# EAGLE design cellyjamjam_v2 (EAGLE 6.5.0)
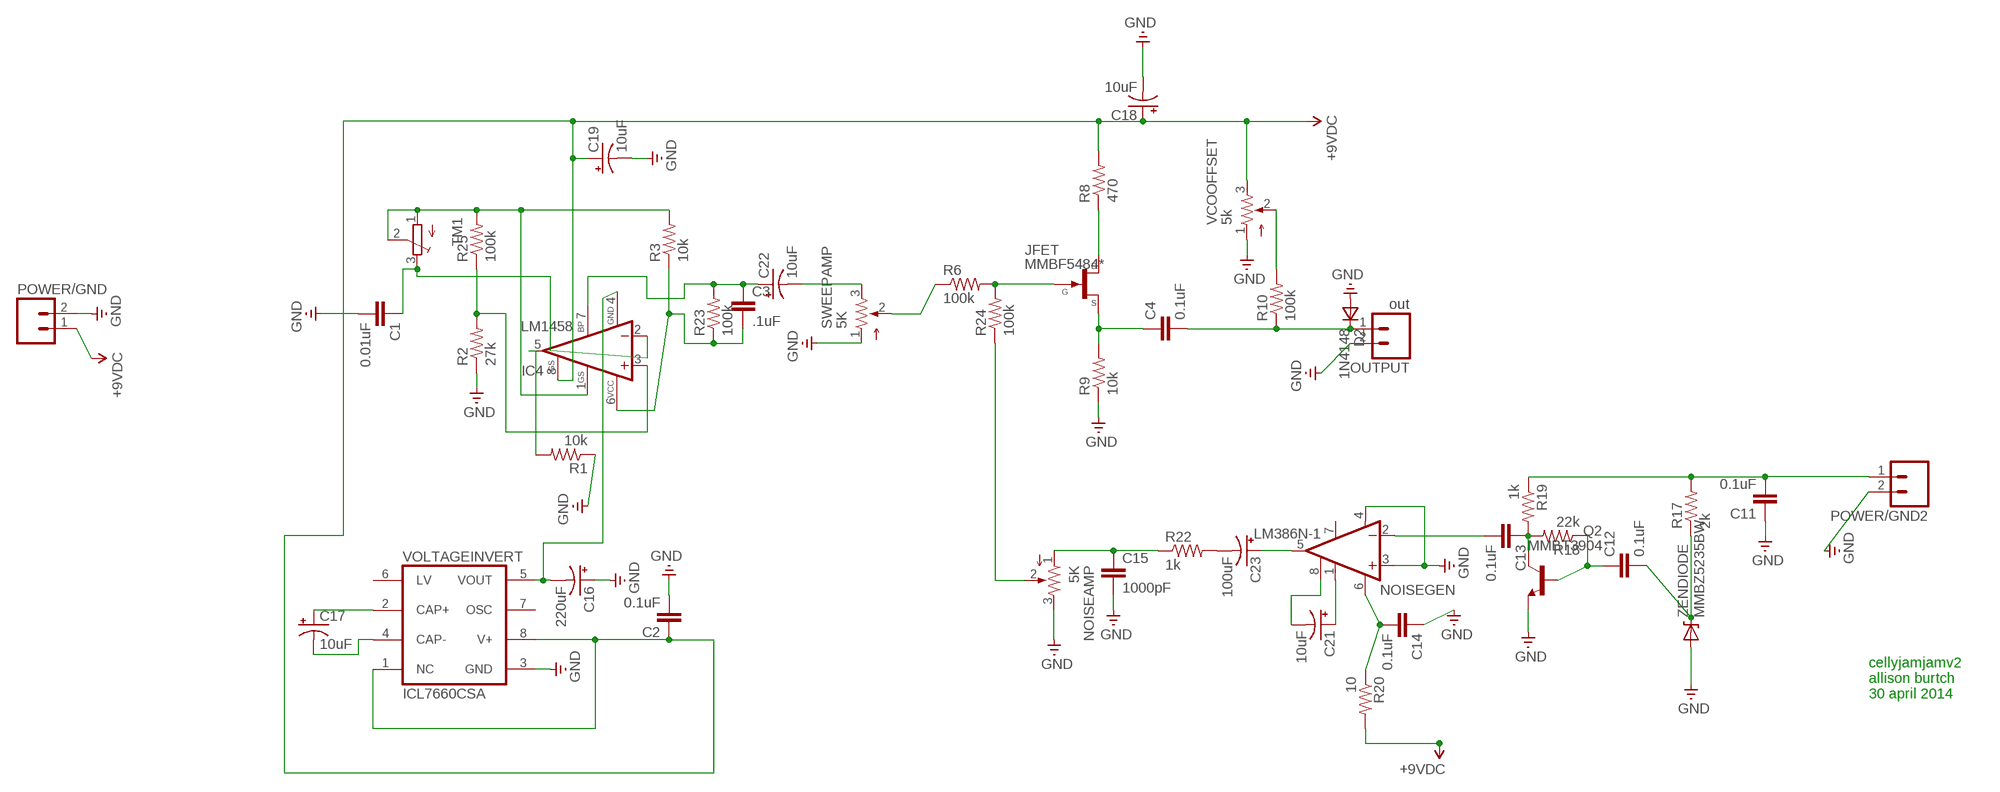
[diagram p0: schematic, sheet 1]

## Parts
C1  0.01uF  CAP0603-CAP  [0603-CAP]
C2  0.1uF  CAP0603-CAP  [0603-CAP]
C3  .1uF  CAP0603-CAP  [0603-CAP]
C4  0.1uF  CAP0603-CAP  [0603-CAP]
C11  0.1uF  CAP0603-CAP  [0603-CAP]
C12  0.1uF  CAP0603-CAP  [0603-CAP]
C13  0.1uF  CAP0603-CAP  [0603-CAP]
C14  0.1uF  CAP0603-CAP  [0603-CAP]
C15  1000pF  CAP0603-CAP  [0603-CAP]
C16  220uF  CAP_POLD  [PANASONIC_D]
C17  10uF  CAP_POLC  [PANASONIC_C]
C18  10uF  CAP_POLC  [PANASONIC_C]
C19  10uF  CAP_POLPTH1  [CPOL-RADIAL-100UF-25V]
C21  10uF  CAP_POLPTH2  [CPOL-RADIAL-10UF-25V]
C22  10uF  CAP_POLC  [PANASONIC_C]
C23  100uF  CAP_POLPTH1  [CPOL-RADIAL-100UF-25V]
D2  1N4148  DSOD323  [SOD323]
IC4  LM1458  LM386M  [SO08@2]
JFET  MMBF5484*  MMBF5484  [SOT23]
NOISEAMP  5K  P160KN  [P160KN]
NOISEGEN  LM386N-1  [DIL08]
OUTPUT  out  M02LOCK_LONGPADS  [1X02_LOCK_LONGPADS]
POWER/GND  M02LOCK_LONGPADS  [1X02_LOCK_LONGPADS]
POWER/GND2  M02LOCK_LONGPADS  [1X02_LOCK_LONGPADS]
Q2  MMBT3904  [SOT23-BEC]
R1  10k  RESISTOR0603-RES  [0603-RES]
R2  27k  RESISTOR0603-RES  [0603-RES]
R3  10k  RESISTOR0603-RES  [0603-RES]
R6  100k  RESISTOR0603-RES  [0603-RES]
R8  470  RESISTOR0603-RES  [0603-RES]
R9  10k  RESISTOR0603-RES  [0603-RES]
R10  100k  RESISTOR0603-RES  [0603-RES]
R17  2k  RESISTOR0603-RES  [0603-RES]
R18  22k  RESISTOR0603-RES  [0603-RES]
R19  1k  RESISTOR0603-RES  [0603-RES]
R20  10  RESISTOR0603-RES  [0603-RES]
R22  1k  RESISTOR0603-RES  [0603-RES]
R23  100k  RESISTOR0603-RES  [0603-RES]
R24  100k  RESISTOR0603-RES  [0603-RES]
R25  100k  RESISTOR0603-RES  [0603-RES]
SWEEPAMP  5K  P160KN  [P160KN]
TM1  TRIMPOTTC33X  [TC33X]
VCOOFFSET  5k  P160KN  [P160KN]
VOLTAGEINVERT  ICL7660CSA  [SO08]
ZENDIODE  MMBZ5235BW  DIODE-ZENERPTH  [DIODE-ZENER]

## Nets
GND: C1.2 C2.2 C11.1 C14.1 C15.2 C16.+ C18.- C19.2(-) D2.2(A) NOISEAMP.3 NOISEGEN.3(+IN) NOISEGEN.4(GND) OUTPUT.2 POWER/GND2.2 POWER/GND.2 Q2.E R1.1 R2.1 R9.1 SWEEPAMP.1 VCOOFFSET.1 VOLTAGEINVERT.3(GND) ZENDIODE.P$2(A)
N$4: C17.+ VOLTAGEINVERT.2(CAP+)
N$5: C17.- VOLTAGEINVERT.4(CAP-)
N$6: C21.1(+) NOISEGEN.1(GAIN)
N$7: C16.- IC4.4(GND) VOLTAGEINVERT.5(VOUT)
N$8: IC4.1(GAIN) R3.2 R25.2 TM1.1(A) TM1.2(S)
N$10: C1.1 IC4.2(-IN) TM1.3(E)
N$11: R6.1 SWEEPAMP.2
N$12: C22.- SWEEPAMP.3
N$14: C3.2 IC4.6(VS) R3.1 R23.1
N$15: C21.2(-) NOISEGEN.8(GAIN)
N$16: C12.1 Q2.B R18.1
N$18: C13.2 NOISEGEN.2(-IN)
N$19: C13.1 Q2.C R18.2 R19.2
N$20: C12.2 R17.1 ZENDIODE.P$1(C)
N$21: C23.2(-) R22.2
N$22: C23.1(+) NOISEGEN.5(OUT)
N$23: C15.1 NOISEAMP.1 R22.1
N$24: C3.1 C22.+ IC4.7(BS2) R23.2
N$25: NOISEAMP.2 R24.1
N$26: C14.2 NOISEGEN.6(VS) R20.1
N$27: JFET.1(D) R8.1
N$30: C4.1 JFET.2(S) R9.2
N$31: R10.2 VCOOFFSET.2
N$33: C11.2 POWER/GND2.1 R17.2 R19.1
N$47: JFET.3(G) R6.2 R24.2
N$48: IC4.5(OUT) R1.2
N$49: IC4.3(+IN) R2.2 R25.1
N$52: C4.2 D2.1(C) OUTPUT.1 R10.1
VCC: C2.1 C18.+ C19.1(+) IC4.8(GAIN) POWER/GND.1 R8.2 R20.2 VCOOFFSET.3 VOLTAGEINVERT.1(NC) VOLTAGEINVERT.8(V+) ; supply symbol labelled +9VDC
Unconnected: NOISEGEN.7(BYPASS) VOLTAGEINVERT.6(LV) VOLTAGEINVERT.7(OSC)

## Notes on the sheet
- cellyjamjamv2
  allison burtch
  30 april 2014

## Library data of the parts
C1-C4 C11-C15 = SparkFun-Passives:CAP: Capacitor Standard 0603 ceramic capacitor, and 0.1" leaded capacitor.
C16-C19 C21-C23 = SparkFun-Capacitors:CAP_POL: Capacitor Polarized These are standard SMD and PTH capacitors. Normally 10uF, 47uF, and 100uF in electrolytic and tantalum varieties. Always verify the external diameter of the through hole cap, it varies with capacity, voltage, and manufacturer. The EIA devices should be standard.
D2 = zetex:D: DIODE; MPN: CDSOD323-T05C; OC_FARNELL: 1824860; OC_NEWARK: 79R6078
IC4 = linear:LM386: Low Voltage Audio Power Amplifier
JFET = transistor-fet:MMBF5484*: N-Channel JFET
NOISEAMP SWEEPAMP VCOOFFSET = pot:P160KN: POTENTIOMETER - 11 mm 6 mm shaft, 18 teeth knurl
NOISEGEN = linear:LM386?-*: Low Voltage Audio Power Amplifier Source: http://cache.national.com/ds/LM/LM386.pdf
OUTPUT POWER/GND POWER/GND2 = SparkFun-Connectors:M02: Standard 2-pin 0.1" header. Use with - straight break away headers ( PRT-00116) - right angle break away headers (PRT-00553) - swiss pins (PRT-00743) - machine pins (PRT-00117) - female headers (PRT-00115) Molex polarized connector foot print use with: PRT-08233 with associated crimp pins and housings. 2.54_SCREWTERM for use with PRT-10571. 3.5mm Screw Terminal footprints for PRT-08084 5mm Screw Terminal footprints for use with PRT-08433
Q2 = transistor-npn:MMBT3904*: NPN TRANSISTOR
R1-R3 R6 R8-R10 R17-R20 R22-R25 = SparkFun-Resistors:RESISTOR: Resistor Basic schematic elements and footprints for 0603, 1206, and PTH resistors.
TM1 = adafruit:TRIMPOT: SMT trimmer potentiometer part number TC33X http://www.ladyada.net/library/eagle
VOLTAGEINVERT = maxim:ICL7660CSA: VOLTAGE CONVERTER; MF: MAXIM; MPN: ICL7660CSA; OC_FARNELL: 9724710; OC_NEWARK: 34C3732
ZENDIODE = SparkFun-DiscreteSemi:DIODE-ZENER: Zener Diode Production Part - 8199 3.4V Zener Voltage

## Board
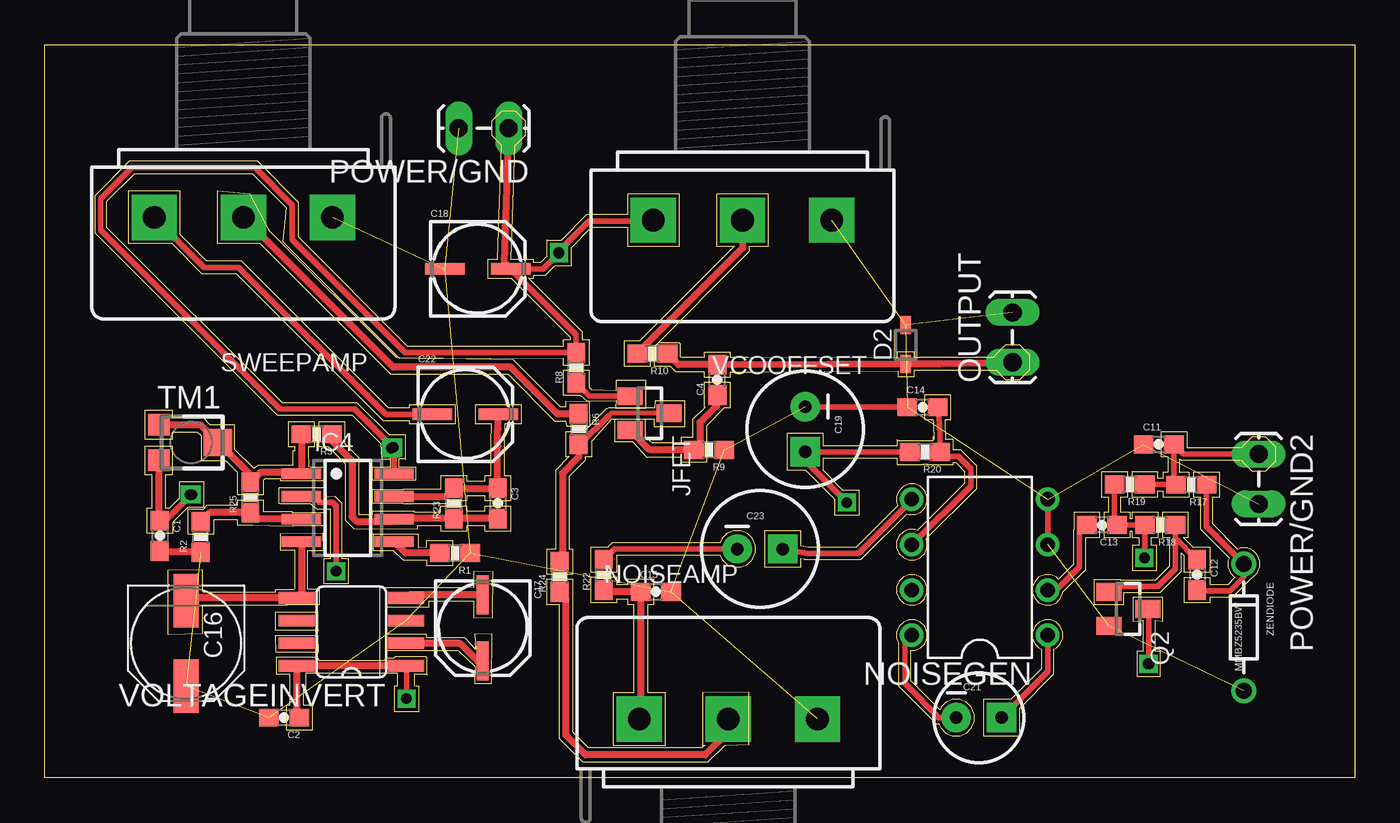
[diagram p1: board, top side]
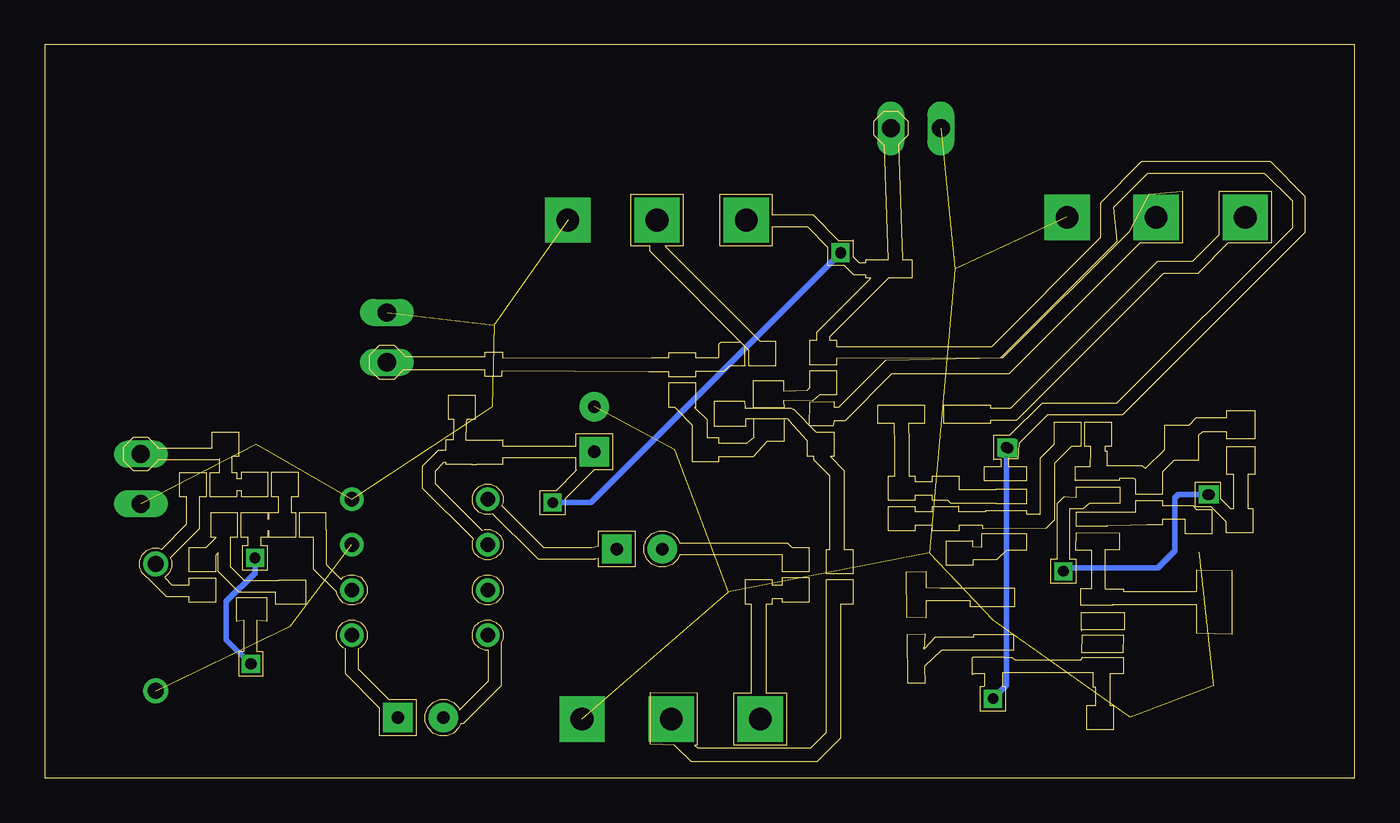
[diagram p2: board, bottom side, seen from below]

Size 73.5 x 41.15 mm. Coordinates in mm from the lower left corner, seen from the top.
Outline: 0,0 0,41.15 73.5,41.15 73.5,0 0,0
Copper layers (1*16): Top 0.035mm / dielectric 1.5mm / Bottom 0.035mm
Design rules "default": minimum track width 10mil, minimum drill 24mil, track to track 8mil, track to pad 8mil, pad to pad 8mil, via to via 8mil, smd to smd 8mil, copper to edge 40mil, drill to drill 8mil, minimum pad ring 10mil, minimum via ring 8mil, stop-mask expansion 4mil, vias tented up to drill 0mil, thermal gap 10mil
Milling: 864 lines

### Footprints (pad centres in the part's own frame; a part is rotated, then mirrored left to right if it is on the bottom)
0603-CAP = smd 1.1 x 1: 1 -0.85,0; 2 0.85,0
PANASONIC_D = smd 3 x 1.4: + 2.4,0; - -2.4,0
PANASONIC_C = smd 2.2 x 0.65: + 1.9,-0.2; - -1.8,-0.2
CPOL-RADIAL-100UF-25V = drill 0.7 pad 1.651 square: 1 1.27,0 | drill 0.7 pad 1.651: 2 -1.27,0
CPOL-RADIAL-10UF-25V = drill 0.7 pad 1.651 square: 1 1.27,0 | drill 0.7 pad 1.651: 2 -1.27,0
SOD323 = smd 1 x 0.6: 1 -1.1,0; 2 1.1,0
SO08@2 = smd 0.6 x 2.2: 1 -1.905,-2.6; 2 -0.635,-2.6; 3 0.635,-2.6; 4 1.905,-2.6; 5 1.905,2.6; 6 0.635,2.6; 7 -0.635,2.6; 8 -1.905,2.6
SOT23 = smd 1 x 1.4: 1 -0.95,-1.1; 2 0.95,-1.1; 3 0,1.1
P160KN = drill 1.27 pad 2.54 square: 1 -3.8,-5; 2 -3.8,0; 3 -3.8,5
DIL08 = drill 0.813 pad 1.27: 1 -3.81,-3.81; 2 -1.27,-3.81; 3 1.27,-3.81; 4 3.81,-3.81; 5 3.81,3.81; 6 1.27,3.81; 7 -1.27,3.81; 8 -3.81,3.81
1X02_LOCK_LONGPADS = drill 1.016 long: 1 -0.127,0; 2 2.667,0
SOT23-BEC = smd 1 x 1.4: B -0.95,-1.1; C 0,1.1; E 0.95,-1.1
0603-RES = smd 1.1 x 1: 1 -0.85,0; 2 0.85,0
TC33X = smd 1.2 x 1.2: 1 -1,-1.825; 3 1,-1.825 | smd 1.5 x 1.6: 2 0,1.5
SO08 = smd 0.66 x 2.032: 1 -1.905,-3.073; 2 -0.635,-3.073; 3 0.635,-3.073; 4 1.905,-3.073; 5 1.905,3.073; 6 0.635,3.073; 7 -0.635,3.073; 8 -1.905,3.073
DIODE-ZENER = drill 0.9: P$1 -3.556,0; P$2 3.556,0

### Placement (x,y rotation side)
C1  6.46,13.59 270 top
C2  13.44,3.39 180 top
C3  25.42,15.41 270 top
C4  37.74,22.34 90 top
C11  62.49,18.72 0 top
C12  64.64,11.4 270 top
C13  59.31,14.2 180 top
C14  49.24,20.8 0 top
C15  34.29,10.45 0 top
C16  7.94,7.56 270 top
C17  24.77,8.47 270 top
C18  24.25,28.77 0 top
C19  42.67,19.57 270 top
C21  52.41,3.38 0 top
C22  23.55,20.6 0 top
C23  40.13,12.85 0 top
D2  48.3,24.32 90 top
IC4  17.01,15.16 270 top
JFET  33.94,20.47 270 top
NOISEAMP  38.35,-0.49 270 top
NOISEGEN  52.46,11.82 90 top
OUTPUT  54.3,23.45 90 top
POWER/GND  25.9,36.45 180 top
POWER/GND2  68.1,18.05 270 top
Q2  60.79,9.49 270 top
R1  23.02,12.62 180 top
R2  8.76,13.53 90 top
R3  15.26,19.29 180 top
R6  29.95,19.58 270 top
R8  29.82,23.02 90 top
R9  37.28,18.41 180 top
R10  34.09,23.81 180 top
R17  64.33,16.46 180 top
R18  62.58,14.2 180 top
R19  60.87,16.47 180 top
R20  49.39,18.29 180 top
R22  31.37,11.4 90 top
R23  22.96,15.41 90 top
R24  28.89,11.29 90 top
R25  11.55,15.74 90 top
SWEEPAMP  11.15,35.26 90 top
TM1  8.23,18.82 270 top
VCOOFFSET  39.15,35.1 90 top
VOLTAGEINVERT  17.21,8.2 90 top
ZENDIODE  67.27,8.45 270 top

### Tracks (layer width: path | path; a pad name or v marks a point on that pad's centre or on a via)
GND  (19 unrouted)
  Top 0.305: C14.1 43.04,20.8 C19.2 | NOISEGEN.4 NOISEGEN.3
  Top 0.406: R2.1 6.52,12.68 C1.2
N$4
  Top 0.406: C17.+ 24.28,6.57 23.3,7.55 20.3,7.55 VOLTAGEINVERT.2
N$5
  Top 0.406: C17.- 20.45,10.27 VOLTAGEINVERT.4
N$6
  Top 0.305: NOISEGEN.1 56.27,5.97 C21.1
N$7
  Top 0.406: IC4.4 14.41,10.38 VOLTAGEINVERT.5 8.09,10.11 C16.-
N$8
  Top 0.406: R3.2 IC4.1 | IC4.1 | IC4.1 14.38,17.07 14.3,17.15 12.11,17.15 R25.2 11.55,17 TM1.2 8.73,19.82 TM1.1
N$10  (via drill 0.6)
  Top 0.305: C1.1 6.79,14.44 v8.25,15.9 | v16.35,11.6 16.35,15.25 16.15,15.45 15.4,15.45 15.05,15.8 IC4.2
  Top 0.406: TM1.3 6.41,14.49 C1.1
  Bottom 0.305: v8.25,15.9 9.9,15.9 10.1,15.7 10.1,12.75 11.05,11.8 16.15,11.8 v16.35,11.6
N$11
  Top 0.406: R6.1 28.77,20.43 26.15,23.05 19.56,23.05 SWEEPAMP.2
N$12
  Top 0.305: C22.- 19.15,20.4 10.9,28.65 8.96,28.65 SWEEPAMP.3
N$13  (via drill 0.6)
  other vias: 16.35,11.6
N$14
  Top 0.406: C3.2 R23.1 19.64,14.56 IC4.6 19.48,14.4 17.5,14.4 17.25,14.65 17.25,17.8 16.11,18.94 R3.1
N$15
  Top 0.305: C21.2 50.17,3.38 48.25,5.3 48.25,7.62 NOISEGEN.8
N$16
  Top 0.305: R18.1 63.43,13.46 | 63.43,13.46 C12.1 | 63.43,13.46 63.43,11.73 62.45,10.75 60,10.75 Q2.B
N$17  (via drill 0.6)
  other vias: 8.15,15.9
N$18
  Top 0.305: NOISEGEN.2 56.75,10.55 58.05,11.85 58.05,13.78 C13.2
N$19  (via drill 0.6)
  Top 0.305: R19.2 60.02,14.34 C13.1 R18.2 61.73,12.38 v61.7,12.35 | v61.95,6.4 61.95,9.42 Q2.C
  Bottom 0.305: v61.7,12.35 61.7,11.5 63.3,9.9 63.3,7.75 v61.95,6.4
N$20
  Top 0.305: R17.1 65.18,14.1 ZENDIODE.P$1 67.27,11.27 66.5,10.5 64.69,10.5 C12.2
N$21
  Top 0.305: C23.2 31.97,12.85 R22.2
N$22
  Top 0.305: NOISEGEN.5 48.65,15.6 45.65,12.6 42.78,12.6 C23.1
N$23
  Top 0.406: R22.1 31.47,10.45 C15.1 33.44,3.39 NOISEAMP.1
N$24
  Top 0.406: IC4.7 22.5,15.79 R23.2 C3.1 25.42,18.62 C22.+
N$25
  Top 0.406: NOISEAMP.2 38.35,2.6 37.05,1.3 30.35,1.3 29.25,2.4 29.25,10.08 R24.1
N$26
  Top 0.305: C14.2 50.19,19.95 R20.1 48.14,18.09 48.1,18.05 51.25,18.05 51.95,17.35 51.95,16.4 NOISEGEN.6
N$27
  Top 0.305: JFET.1 30.57,21.42 R8.1
N$28  (via drill 0.6)
  other vias: 19.45,18.5
N$29  (via drill 0.6)
  other vias: 20.3,4.45
N$30
  Top 0.406: JFET.2 33.94,18.41 R9.2 36.75,18.73 36.75,19.95 37.74,20.94 C4.1
N$31
  Top 0.406: VCOOFFSET.2 39.15,29.72 R10.2
N$33
  Top 0.305: R19.1 61.73,16.46 R17.2 63.34,16.59 C11.2 63.89,18.18 POWER/GND2.1
N$34  (via drill 0.6)
  other vias: 61.9,6.4
N$37  (via drill 0.6)
  other vias: 28.85,29.5
N$38  (via drill 0.6)
  other vias: 45,15.45
N$47
  Top 0.254: JFET.3 31.77,20.47 31.65,20.35
  Top 0.305: R6.2 30.03,18.73 31.65,20.35
  Top 0.406: R6.2 29.95,18 29.05,17.1 29.05,12.3 R24.2
N$48
  Top 0.406: R1.2 20.25,12.62 IC4.5
N$49
  Top 0.406: IC4.3 11.91,14.53 R25.1 9.27,14.89 R2.2
N$52
  Top 0.406: OUTPUT.1 50.2,23.23 D2.1 39.47,23.18 C4.2 35.56,23.19 R10.1
VCC  (via drill 0.6)
  Top 0.305: IC4.8 19.61,18.29 19.45,18.45 19.4,18.45 19.35,18.5 19.5,18.5 v19.55,18.55 17.4,20.7 13.2,20.7 3.15,30.75 3.15,32.5 4.9,34.25 11.8,34.25 13.9,32.15 13.9,30.2 20.23,23.87 R8.2 29.82,24.89 C18.+ 27.97,28.57 v28.85,29.45 28.85,29.55 30.55,31.25 34.1,31.25 VCOOFFSET.3 | v20.3,4.45 20.3,6.28 VOLTAGEINVERT.1 | R20.2 C19.1 42.67,17.78 v45,15.45
  Top 0.406: C2.1 14.14,3.54 VOLTAGEINVERT.8 VOLTAGEINVERT.1 | POWER/GND.1 25.78,28.94 C18.+
  Bottom 0.305: v19.55,18.55 19.55,5.2 v20.3,4.45 | v45,15.45 42.85,15.45 v28.85,29.45